# Altium project LM_HTR_001_Rev_C1.PrjPcb (part 1 of 2)
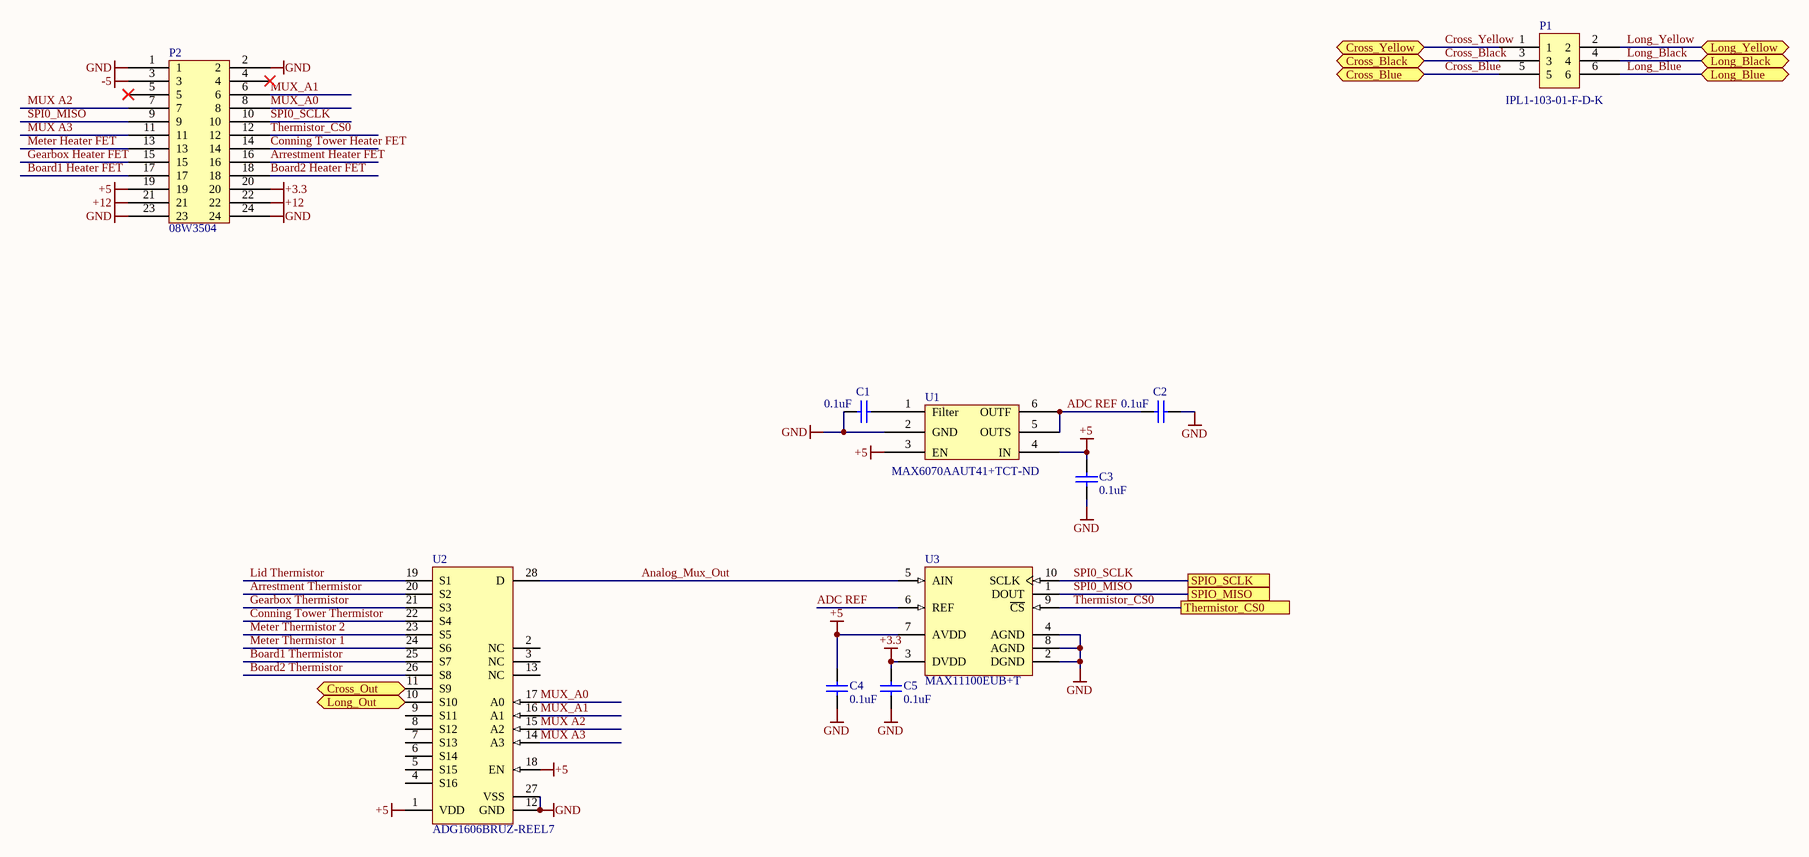
[diagram p0: LM_HTR_001.SchDoc]
5 sheets, 183 parts. Net scope: flat (ports and power ports of the same name join across sheets).
Board file: LM_HTR_001.PcbDoc
Sheets:
  LM_HTR_001.SchDoc
  Signal_Conditioner.SchDoc
  HTR_Bridge1.SchDoc
  HTR_Bridge2.SchDoc
  HTR_Bridge3.SchDoc

## Sheet LM_HTR_001.SchDoc: Land Meter Heater Assembly
size Tabloid; DocumentNumber: LM_HTR_001; Revision: A; SheetNumber: 1; SheetTotal: 1

### Parts
C1  0.1uF  [CAPC0402(1005)60_L]
C2  0.1uF  [CAPC0402(1005)60_L]
C3  0.1uF  [CAPC0402(1005)60_L]
C4  0.1uF  [CAPC0402(1005)60_L]
C5  0.1uF  [CAPC0402(1005)60_L]
P1  Manufacturer Part Number: IPL1-103-01-F-D-K  [IPL1-103-01-F-D]  (hidden comment: IPL1-103-01-F-D)
P2  Supplier Part Number 1: 08W3504  [IPL1-112-01-F-S-K]  (hidden comment: IPL1-112-01-F-S-K)
U1  Supplier Part Number 1: MAX6070AAUT41+TCT-ND  [SOT95P280X445-6N]  (hidden comment: MAX6070AAUT41+T)
U2  ADG1606BRUZ-REEL7  [ADI-RU-28_M]
U3  MAX11100EUB+T  [U10+2_L]

### Ports
Cross_Black, Cross_Blue, Cross_Out, Cross_Yellow, Long_Black, Long_Blue, Long_Out, Long_Yellow, SPIO_MISO, SPIO_SCLK, Thermistor_CS0

### Nets
+3.3: C5.1 P2.20 U3.3(DVDD)
+5: C3.1 C4.1 P2.19 U1.3(EN) U1.4(IN) U2.1(VDD) U2.18(EN) U3.7(AVDD)
+12: P2.21 P2.22
-5: P2.3
GND: C1.2 C2.1 C3.2 C4.2 C5.2 P2.1 P2.2 P2.23 P2.24 U1.2(GND) U2.12(GND) U2.27(VSS) U3.2(DGND) U3.4(AGND) U3.8(AGND)
ADC REF: C2.2 U1.5(OUTS) U1.6(OUTF) U3.6(REF)
Analog_Mux_Out: U2.28(D) U3.5(AIN)
Arrestment Heater FET: P2.16
Arrestment Thermistor: U2.20(S2)
Board1 Heater FET: P2.17
Board1 Thermistor: U2.25(S7)
Board2 Heater FET: P2.18
Board2 Thermistor: U2.26(S8)
Conning Tower Heater FET: P2.14
Conning Tower Thermistor: U2.22(S4)
Cross_Black: P1.3 ; port Cross_Black  [project net CROSS NEUTRAL]
Cross_Blue: P1.5 ; port Cross_Blue
Cross_Yellow: P1.1 ; port Cross_Yellow
Gearbox Heater FET: P2.15
Gearbox Thermistor: U2.21(S3)
Lid Thermistor: U2.19(S1)
Long_Black: P1.4 ; port Long_Black  [project net LONG NEUTRAL]
Long_Blue: P1.6 ; port Long_Blue
Long_Yellow: P1.2 ; port Long_Yellow
Meter Heater FET: P2.13
Meter Thermistor 1: U2.24(S6)
Meter Thermistor 2: U2.23(S5)
MUX A2: P2.7 U2.15(A2)
MUX A3: P2.11 U2.14(A3)
MUX_A0: P2.8 U2.17(A0)
MUX_A1: P2.6 U2.16(A1)
SPI0_MISO: P2.9 U3.1(DOUT) ; port SPIO_MISO
SPI0_SCLK: P2.10 U3.10(SCLK) ; port SPIO_SCLK
Thermistor_CS0: P2.12 U3.9(~{CS}) ; port Thermistor_CS0
NetC1_1: C1.1 U1.1(Filter)
NetTP2_1: U2.10(S10) ; port Long_Out
NetTP6_1: U2.11(S9) ; port Cross_Out

Not connected (* = marked no-connect by the designer): P2 4* 5*; U2 2(NC) 3(NC) 4(S16) 5(S15) 6(S14) 7(S13) 8(S12) 9(S11) 13(NC)

### Notes on the sheet
- Title
- Size:
- Date:
- Tabloid
- Number:
- Time:
- Revision:
- Sheet
- of
- ZLS Corporation
- 7801 North Lamar Blvd.
- Suite E-184
- Austin, Texas 78752  USA
- (512) 453-0288
- File:

### Library data of the parts
C1-C5 = CMP-1034-00252-1: CAP CER 0.1UF 10V X7R 0402; Manufacturer: Murata Electronics North America; Manufacturer Part Number: GRM155R71A104KA01D; Tolerance: ±10%; Supplier 1: Digi-Key; Supplier Part Number 1: 490-6321-1-ND; RoHS: RoHS Compliant; Category: Capacitors; Stock 1: 2920395; Pricing 1: 1=0.1, 10=0.014, 100=0.0063, 500=0.00446, 1000=0.00351, 2500=0.00319, 5000=0.00293 (USD); Packaging: Cut Tape (CT); Part Status: Active; Voltage - Rated: 10V; Temperature Coefficient: X7R; Operating Temperature: -55°C ~ 125°C; Features: -; Ratings: -; Applications: General Purpose; Mounting Type: Surface Mount, MLCC; Package / Case: 0402 (1005 Metric); Size / Dimension: 0.039" L x 0.020" W (1.00mm x 0.50mm); Height - Seated (Max): -; Thickness (Max): 0.022" (0.55mm); Lead Spacing: -; ComponentLink1URL: http://www.murata.com/~/media/webrenewal/support/library/catalog/products/capacitor/mlcc/c02e.ashx?la=en-us; ComponentLink1Description: http://www.murata.com/~/media/webrenewal/support/library/catalog/products/capacitor/mlcc/c02e.ashx?la=en-us
P1 = IPL1-103-01-F-D: Manufacturer: SAMTEC; Supplier 1: Newark; Supplier Part Number 1: 51P2678; Stock 1: 0; Pricing 1: 1=1.8, 5000=1.56, 10000=1.46 (USD); ComponentLink1URL: https://webassistants.partcommunity.com/23d-libs/samtec/search/resolve.html?EMAIL=mysamtec@samtec.com&PN=HTSW-114-05-F-D; ComponentLink1Description: https://webassistants.partcommunity.com/23d-libs/samtec/search/resolve.html?EMAIL=mysamtec@samtec.com&PN=HTSW-114-05-F-D
P2 = IPL1-112-01-F-S-K: IPL1-112-01-F-D-K; Supplier 1: Newark
U1 = MAX6070AAUT41+T: IC VREF SERIES 4.096V SOT23; Manufacturer: Maxim Integrated; Output Type: Fixed; Tolerance: ±0.04%; Temperature Coefficient: 6ppm/°C; Noise - 0.1Hz to 10Hz: 9.6µVp-p; Noise - 10Hz to 10kHz: 9µVrms; Voltage - Input: 4.3 V ~ 5.5 V; Current - Supply: 350µA; Supplier 1: Digi-Key; Manufacturer Part Number: MAX6070AAUT41+T; RoHS: RoHS Compliant; Category: Integrated Circuits (ICs); Stock 1: 2623; Pricing 1: 1=3.41, 10=3.213, 25=2.5704, 50=2.4418, 100=2.2491, 250=2.13344, 500=2.05634 (USD); Packaging: Cut Tape (CT); Part Status: Active; Reference Type: Series; Voltage - Output (Min/Fixed): 4.096V; Operating Temperature: -40°C ~ 125°C (TA); Mounting Type: Surface Mount; Package / Case: SOT-23-6; Supplier Device Package: SOT-23-6; ComponentLink1URL: https://datasheets.maximintegrated.com/en/ds/MAX6070-MAX6071.pdf; ComponentLink1Description: https://datasheets.maximintegrated.com/en/ds/MAX6070-MAX6071.pdf
U2 = CMP-0793-00166-1: 4.5 Ohm Ron, 16-Channel, +/-5 V,+12 V,+5 V and +3.3 V Multiplexer, 28-pin SOP (RU-28), Reel; Manufacturer: Analog Devices; Ron (ohms): 4; t transition (s): 143n; Bandwidth (Hz): 21M, 22M, 19M, 17M; Max Analog Signal Range: Vss to Vdd; ComponentLink1URL: http://www.analog.com/en/index.html; PartNumber: ADG1606BRUZ-REEL7; ComponentLink3URL: http://www.analog.com/static/imported-files/packages/249854663RU_28.pdf; ComponentLink2URL: http://www.analog.com/static/imported-files/data_sheets/ADG1606_1607.pdf; ComponentLink2Description: Datasheet; Mounting Technology: Surface Mount; PackageDescription: 28-Pin Thin Shrink Small Outline Package, Body 9.7 x 4.4 mm, Pitch 0.65 mm; PackageReference: RU-28; ComponentLink3Description: Package Specification; Packing: Reel; Code_JEDEC: MO-153-AE; DatasheetVersion: Rev. 0; ComponentLink1Description: Manufacturer URL; PackageVersion: Mar-05
U3 = CMP-0249-00017-1: 16-Bit, +5V, 200ksps ADC with 10uA Shutdown, 10-Pin uMAX, -40°C to +85°C, Pb-Free, Tape and Reel; DatasheetVersion: Rev 1, Jan-2012; ComponentLink3URL: http://pdfserv.maxim-ic.com/package_dwgs/21-0061.PDF; PackageReference: U10+2; ComponentLink2URL: http://datasheets.maxim-ic.com/en/ds/MAX11100.pdf; PackageVersion: revL, 2008; ComponentLink1Description: Manufacturer URL; Code_JEDEC: MO-187-BA; ComponentLink1URL: http://www.maxim-ic.com; ComponentLink3Description: Package Specification; PackageDescription: 10-Pin Micro-MAX Thin Shrink Small Outline (uSOP), 3 x 3 x 0.85 mm Body, 0.5 mm Pitch, Pb-Free; ComponentLink2Description: Datasheet

## Sheet Signal_Conditioner.SchDoc: Signal Conditioner
size Tabloid; DocumentNumber: LM-001; Revision: C; SheetNumber: 2; SheetTotal: 2; DocumentName: Signal Conditioner
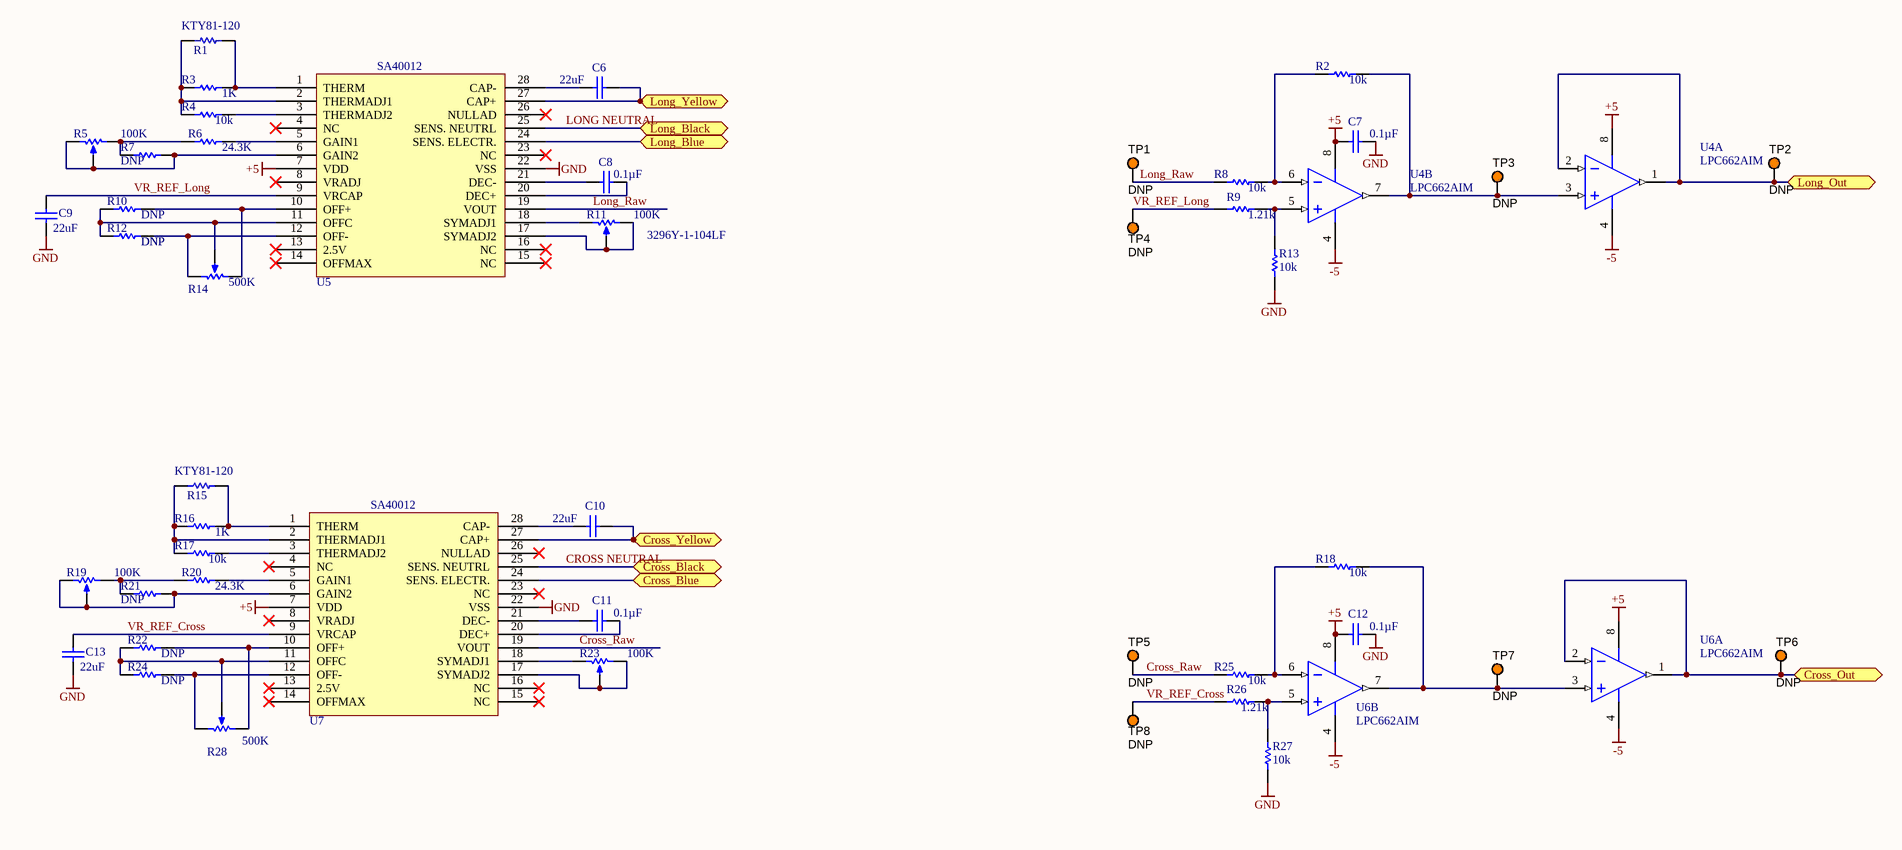
[diagram p1: Signal_Conditioner.SchDoc]

### Parts
C6  22uF  [CAPC0805(2012)145_N]
C7  Capacitance: 0.1µF  [CAPC0805(2012)145_N]  (hidden comment: CAP CER 0.1UF 25V X7R 0805)
C8  Capacitance: 0.1µF  [CAPC0805(2012)145_N]  (hidden comment: CAP CER 0.1UF 25V X7R 0805)
C9  22uF  [CAPC0805(2012)145_N]
C10  22uF  [CAPC0805(2012)145_N]
C11  Capacitance: 0.1µF  [CAPC0805(2012)145_N]  (hidden comment: CAP CER 0.1UF 25V X7R 0805)
C12  Capacitance: 0.1µF  [CAPC0805(2012)145_N]  (hidden comment: CAP CER 0.1UF 25V X7R 0805)
C13  22uF  [CAPC0805(2012)145_N]
R1  KTY81-120  [KTY81-120]
R2  10k  [RESC0805(2012)_L]
R3  1K  [RESC0805(2012)_L]
R4  10k  [RESC0805(2012)_L]
R5  100K  [Trimmer 2.54]
R6  24.3K  [RESC0805(2012)_L]
R7  DNP  [RESC0805(2012)_L]
R8  10k  [RESC0805(2012)_L]
R9  1.21k  [RESC0805(2012)_L]
R10  DNP  [RESC0805(2012)_L]
R11  100K  [Trimmer 2.54]
R12  DNP  [RESC0805(2012)_L]
R13  10k  [RESC0805(2012)_L]
R14  500K  [Trimmer 2.54]
R15  KTY81-120  [KTY81-120]
R16  1K  [RESC0805(2012)_L]
R17  10k  [RESC0805(2012)_L]
R18  10k  [RESC0805(2012)_L]
R19  100K  [Trimmer 2.54]
R20  24.3K  [RESC0805(2012)_L]
R21  DNP  [RESC0805(2012)_L]
R22  DNP  [RESC0805(2012)_L]
R23  100K  [Trimmer 2.54]
R24  DNP  [RESC0805(2012)_L]
R25  10k  [RESC0805(2012)_L]
R26  1.21k  [RESC0805(2012)_L]
R27  10k  [RESC0805(2012)_L]
R28  500K  [Trimmer 2.54]
TP1  DNP  [KSTN-5003]
TP2  DNP  [KSTN-5003]
TP3  DNP  [KSTN-5003]
TP4  DNP  [KSTN-5003]
TP5  DNP  [KSTN-5003]
TP6  DNP  [KSTN-5003]
TP7  DNP  [KSTN-5003]
TP8  DNP  [KSTN-5003]
U4  LPC662AIM  [D0008A_M]  (parts A,B of 2)
U5  SA40012  [SA40012]
U6  LPC662AIM  [D0008A_M]  (parts A,B of 2)
U7  SA40012  [SA40012]

### Ports
Cross_Black, Cross_Blue, Cross_Out, Cross_Yellow, Long_Black, Long_Blue, Long_Out, Long_Yellow

### Nets
+5: C7.1 C12.1 U4.8(V+) U5.7(VDD) U6.8(V+) U7.7(VDD)
-5: U4.4(V-) U6.4(V-)
GND: C7.2 C9.2 C12.2 C13.2 R13.1 R27.1 U5.22(VSS) U7.22(VSS)
CROSS NEUTRAL: U7.25(SENS._NEUTRL) ; port Cross_Black
Cross_Blue: U7.24(SENS._ELECTR.) ; port Cross_Blue
Cross_Raw: R25.1 TP5.1 U7.19(VOUT)
Cross_Yellow: C10.2 U7.27(CAP+) ; port Cross_Yellow
LONG NEUTRAL: U5.25(SENS._NEUTRL) ; port Long_Black
Long_Blue: U5.24(SENS._ELECTR.) ; port Long_Blue
Long_Raw: R8.1 TP1.1 U5.19(VOUT)
Long_Yellow: C6.2 U5.27(CAP+) ; port Long_Yellow
VR_REF_Cross: C13.1 R26.2 TP8.1 U7.9(VRCAP)
VR_REF_Long: C9.1 R9.2 TP4.1 U5.9(VRCAP)
NetC6_1: C6.1 U5.28(CAP-)
NetC8_1: C8.1 U5.21(DEC-)
NetC8_2: C8.2 U5.20(DEC+)
NetC10_1: C10.1 U7.28(CAP-)
NetC11_1: C11.1 U7.21(DEC-)
NetC11_2: C11.2 U7.20(DEC+)
NetR1_1: R1.1 R3.1 R4.1 U5.2(THERMADJ1)
NetR1_2: R1.2 R3.2 U5.1(THERM)
NetR2_1: R2.1 R8.2 U4.6(INB-)
NetR2_2: R2.2 TP3.1 U4.3(INA+) U4.7(OUTB)
NetR4_2: R4.2 U5.3(THERMADJ2)
NetR5_1: R5.1(a) R5.2(b) R7.2 U5.6(GAIN2)
NetR5_3: R5.3(c) R6.1 R7.1
NetR6_2: R6.2 U5.5(GAIN1)
NetR9_1: R9.1 R13.2 U4.5(INB+)
NetR10_1: R10.1 R12.1 R14.2(b) U5.11(OFFC)
NetR10_2: R10.2 R14.1(a) U5.10(OFF+)
NetR11_1: R11.1(a) U5.18(SYMADJ1)
NetR11_2: R11.2(b) R11.3(c) U5.17(SYMADJ2)
NetR12_2: R12.2 R14.3(c) U5.12(OFF-)
NetR15_1: R15.1 R16.1 R17.1 U7.2(THERMADJ1)
NetR15_2: R15.2 R16.2 U7.1(THERM)
NetR17_2: R17.2 U7.3(THERMADJ2)
NetR18_1: R18.1 R25.2 U6.6(INB-)
NetR18_2: R18.2 TP7.1 U6.3(INA+) U6.7(OUTB)
NetR19_1: R19.1(a) R19.2(b) R21.2 U7.6(GAIN2)
NetR19_3: R19.3(c) R20.1 R21.1
NetR20_2: R20.2 U7.5(GAIN1)
NetR22_1: R22.1 R24.1 R28.2(b) U7.11(OFFC)
NetR22_2: R22.2 R28.1(a) U7.10(OFF+)
NetR23_1: R23.1(a) U7.18(SYMADJ1)
NetR23_2: R23.2(b) R23.3(c) U7.17(SYMADJ2)
NetR24_2: R24.2 R28.3(c) U7.12(OFF-)
NetR26_1: R26.1 R27.2 U6.5(INB+)
NetTP2_1: TP2.1 U4.1(OUTA) U4.2(INA-) ; port Long_Out
NetTP6_1: TP6.1 U6.1(OUTA) U6.2(INA-) ; port Cross_Out

Not connected (* = marked no-connect by the designer): U5 4(NC)* 8(VRADJ)* 13(2.5V)* 14(OFFMAX)* 15(NC)* 16(NC)* 23(NC)* 26(NULLAD)*; U7 4(NC)* 8(VRADJ)* 13(2.5V)* 14(OFFMAX)* 15(NC)* 16(NC)* 23(NC)* 26(NULLAD)*

### Notes on the sheet
- (near R12) DNP
- (near R11) 3296Y-1-104LF
- Title
- Size:
- Date:
- Tabloid
- Number:
- Time:
- Revision:
- Sheet
- of
- ZLS Corporation
- 7801 North Lamar Blvd.
- Suite E-184
- Austin, Texas 78752  USA
- (512) 453-0288
- File:

### Library data of the parts
C6 C9 C10 C13 = CMP-1036-04795-1: CAP CER 22UF 16V X5R 0805; Manufacturer: Murata Electronics North America; Manufacturer Part Number: GRM219R61C226ME15L; Tolerance: ±20%; Notification: Current market demand for these product types have resulted in fluctuating and extending lead times. Lead times may differ.; Supplier 1: Digi-Key; Supplier Part Number 1: 490-9952-1-ND; RoHS: RoHS Compliant; Category: Capacitors; Stock 1: 200; Pricing 1: 1=0.51, 10=0.359, 100=0.2364, 500=0.1751, 1000=0.14884 (USD); Packaging: Cut Tape (CT); Part Status: Active; Voltage - Rated: 16V; Temperature Coefficient: X5R; Operating Temperature: -55°C ~ 85°C; Features: -; Ratings: -; Applications: General Purpose; Mounting Type: Surface Mount, MLCC; Package / Case: 0805 (2012 Metric); Size / Dimension: 0.079" L x 0.049" W (2.00mm x 1.25mm); Height - Seated (Max): -; Thickness (Max): 0.039" (1.00mm); Lead Spacing: -; Lead Style: -; ComponentLink1URL: http://search.murata.co.jp/Ceramy/image/img/A01X/G101/ENG/GRM219R61C226ME15-01.pdf; ComponentLink1Description: http://search.murata.co.jp/Ceramy/image/img/A01X/G101/ENG/GRM219R61C226ME15-01.pdf
C7 C8 C11 C12 = CMP-1036-04795-1: Manufacturer: Murata Electronics North America; Manufacturer Part Number: GRM21BR71E104KA01L; Tolerance: ±10%; Supplier 1: Digi-Key; Supplier Part Number 1: 490-1673-6-ND; RoHS: RoHS Compliant; Category: Capacitors; Stock 1: 891652; Pricing 1: 1=0.2, 10=0.145, 100=0.0683, 500=0.04788, 1000=0.03964 (USD); Packaging: Digi-Reel®; Part Status: Active; Voltage - Rated: 25V; Temperature Coefficient: X7R; Operating Temperature: -55°C ~ 125°C; Features: -; Ratings: -; Applications: General Purpose; Mounting Type: Surface Mount, MLCC; Package / Case: 0805 (2012 Metric); Size / Dimension: 0.079" L x 0.049" W (2.00mm x 1.25mm); Height - Seated (Max): -; Thickness (Max): 0.053" (1.35mm); Lead Spacing: -; Lead Style: -; ComponentLink1URL: http://www.murata.com/~/media/webrenewal/support/library/catalog/products/capacitor/mlcc/c02e.ashx; ComponentLink1Description: http://www.murata.com/~/media/webrenewal/support/library/catalog/products/capacitor/mlcc/c02e.ashx
R1 R15 = KTY81-120: THERMISTOR PTC 1K OHM PBCYT2; Manufacturer: NXP USA Inc.; Manufacturer Part Number: KTY81/120,112; Supplier 1: Digi-Key; Supplier Part Number 1: 568-12506-ND; RoHS: RoHS Compliant; Category: Sensors, Transducers; Stock 1: 2002; Pricing 1: 1=1.11, 5=1.068, 10=0.868, 25=0.748, 50=0.648, 100=0.5878, 500=0.49432, 1000=0.44088, 5000=0.4008 (USD); Packaging: Bulk; Part Status: Active; Resistance Tolerance: -; Operating Temperature: -55°C ~ 150°C; Mounting Type: Through Hole; Package / Case: TO-226-2, TO-92-2 (TO-226AC); Supplier Device Package: PBCYT2; ComponentLink1URL: http://www.nxp.com/documents/data_sheet/KTY81_SER.pdf; ComponentLink1Description: http://www.nxp.com/documents/data_sheet/KTY81_SER.pdf
R2 R4 R7 R8 R13 R17 R18 R21 R25 R27 = CMP-1013-00393-1: RES SMD 10K OHM 1% 1/8W 0805; Manufacturer: Vishay Dale; Manufacturer Part Number: CRCW080510K0FKEA; Power (Watts): 0.125W, 1/8W; Temperature Coefficient: ±100ppm/°C; Supplier 1: Digi-Key; Supplier Part Number 1: 541-10.0KCCT-ND; RoHS: RoHS Compliant; Category: Resistors; Stock 1: 1858038; Pricing 1: 1=0.1, 10=0.055, 100=0.0223, 1000=0.01003, 2500=0.0087 (USD); Packaging: Cut Tape (CT); Part Status: Active; Tolerance: ±1%; Composition: Thick Film; Features: Automotive AEC-Q200; Operating Temperature: -55°C ~ 155°C; Package / Case: 0805 (2012 Metric); Supplier Device Package: 0805; Size / Dimension: 0.079" L x 0.049" W (2.00mm x 1.25mm); Height - Seated (Max): 0.020" (0.50mm); Failure Rate: -; ComponentLink1URL: http://www.vishay.com/docs/20035/dcrcwe3.pdf; ComponentLink1Description: http://www.vishay.com/docs/20035/dcrcwe3.pdf
R3 R16 = CMP-1013-00393-1: RES SMD 1K OHM 1% 1/8W 0805; Manufacturer: Vishay Dale; Manufacturer Part Number: CRCW08051K00FKEA; Power (Watts): 0.125W, 1/8W; Temperature Coefficient: ±100ppm/°C; Supplier 1: Digi-Key; Supplier Part Number 1: 541-1.00KCCT-ND; RoHS: RoHS Compliant; Category: Resistors; Stock 1: 157631; Pricing 1: 1=0.1, 10=0.055, 100=0.0223, 1000=0.01003, 2500=0.0087 (USD); Packaging: Cut Tape (CT); Part Status: Active; Tolerance: ±1%; Composition: Thick Film; Features: Automotive AEC-Q200; Operating Temperature: -55°C ~ 155°C; Package / Case: 0805 (2012 Metric); Supplier Device Package: 0805; Size / Dimension: 0.079" L x 0.049" W (2.00mm x 1.25mm); Height - Seated (Max): 0.020" (0.50mm); Failure Rate: -; ComponentLink1URL: http://www.vishay.com/docs/20035/dcrcwe3.pdf; ComponentLink1Description: http://www.vishay.com/docs/20035/dcrcwe3.pdf
R5 R11 R19 R23 = Trimmer: TRIMMER 5K OHM 0.25W PC PIN; Manufacturer: Bourns Inc.; Manufacturer Part Number: 3296Y-1-104LF; Power (Watts): 0.5W, 1/2W; Tolerance: ±10%; Temperature Coefficient: ±100ppm/°C; Adjustment Type: Top Adjustment; Resistive Material: Cermet; Supplier 1: Digi-Key; Supplier Part Number 1: 3296Y-104LF-ND; RoHS: RoHS Compliant; Category: Potentiometers, Variable Resistors; Stock 1: 10872; Pricing 1: 1=2.41, 10=2.117, 25=1.898, 50=1.825, 100=1.752, 250=1.679, 500=1.387, 1000=1.314, 5000=1.095 (USD); Packaging: Tube; Part Status: Active; Mounting Type: Through Hole; Termination Style: PC Pins; Size / Dimension: Rectangular - 0.375" x 0.190" Face x 0.395" H (9.53mm x 4.83mm x 10.03mm); ComponentLink1URL: https://www.bourns.com/docs/Product-Datasheets/3296.pdf; ComponentLink1Description: https://www.bourns.com/docs/Product-Datasheets/3296.pdf
R6 R20 = CMP-1013-00393-1: RES SMD 24.3K OHM 1% 1/8W 0805; Manufacturer: Vishay Dale; Manufacturer Part Number: CRCW080524K3FKEA; Power (Watts): 0.125W, 1/8W; Temperature Coefficient: ±100ppm/°C; Supplier 1: Digi-Key; Supplier Part Number 1: 541-24.3KCCT-ND; RoHS: RoHS Compliant; Category: Resistors; Stock 1: 35; Pricing 1: 1=0.1, 10=0.055, 100=0.0223, 1000=0.01003, 2500=0.0087 (USD); Packaging: Cut Tape (CT); Part Status: Active; Tolerance: ±1%; Composition: Thick Film; Features: Automotive AEC-Q200; Operating Temperature: -55°C ~ 155°C; Package / Case: 0805 (2012 Metric); Supplier Device Package: 0805; Size / Dimension: 0.079" L x 0.049" W (2.00mm x 1.25mm); Height - Seated (Max): 0.020" (0.50mm); Failure Rate: -; ComponentLink1URL: http://www.vishay.com/docs/20035/dcrcwe3.pdf; ComponentLink1Description: http://www.vishay.com/docs/20035/dcrcwe3.pdf
R9 R26 = CMP-1013-00393-1: RES SMD 1.21K OHM 1% 1/8W 0805; Manufacturer: Vishay Dale; Manufacturer Part Number: CRCW08051K21FKEA; Power (Watts): 0.125W, 1/8W; Temperature Coefficient: ±100ppm/°C; Supplier 1: Digi-Key; Supplier Part Number 1: 541-1.21KCCT-ND; RoHS: RoHS Compliant; Category: Resistors; Stock 1: 93438; Pricing 1: 1=0.1, 10=0.055, 100=0.0223, 1000=0.01003, 2500=0.0087 (USD); Packaging: Cut Tape (CT); Part Status: Active; Tolerance: ±1%; Composition: Thick Film; Features: Automotive AEC-Q200; Operating Temperature: -55°C ~ 155°C; Package / Case: 0805 (2012 Metric); Supplier Device Package: 0805; Size / Dimension: 0.079" L x 0.049" W (2.00mm x 1.25mm); Height - Seated (Max): 0.020" (0.50mm); Failure Rate: -; ComponentLink1URL: http://www.vishay.com/docs/20035/dcrcwe3.pdf; ComponentLink1Description: http://www.vishay.com/docs/20035/dcrcwe3.pdf
R10 R12 R22 R24 = CMP-1013-00393-1: RES SMD 249K OHM 1% 1/8W 0805; Manufacturer: Vishay Dale; Manufacturer Part Number: CRCW0805249KFKECC; Power (Watts): 0.125W, 1/8W; Temperature Coefficient: ±100ppm/°C; Supplier 1: Digi-Key; Supplier Part Number 1: 541-4128-1-ND; RoHS: RoHS Compliant; Category: Resistors; Stock 1: 19464; Pricing 1: 1=0.1, 10=0.06, 100=0.0244, 1000=0.01094, 2500=0.0095, 5000=0.00785 (USD); Packaging: Cut Tape (CT); Part Status: Active; Tolerance: ±1%; Composition: Thick Film; Features: -; Operating Temperature: -55°C ~ 155°C; Package / Case: 0805 (2012 Metric); Supplier Device Package: 0805; Size / Dimension: 0.079" L x 0.049" W (2.00mm x 1.25mm); Height - Seated (Max): 0.024" (0.60mm); Failure Rate: -; ComponentLink1URL: http://www.vishay.com/docs/28773/crcwce3.pdf; ComponentLink1Description: http://www.vishay.com/docs/28773/crcwce3.pdf
R14 R28 = Trimmer: TRIMMER 500K OHM 0.5W PC PIN TOP; Manufacturer: Bourns Inc.; Manufacturer Part Number: 3296Y-1-504LF; Power (Watts): 0.5W, 1/2W; Tolerance: ±10%; Temperature Coefficient: ±100ppm/°C; Adjustment Type: Top Adjustment; Resistive Material: Cermet; Supplier 1: Digi-Key; Supplier Part Number 1: 3296Y-504LF-ND; RoHS: RoHS Compliant; Category: Potentiometers, Variable Resistors; Stock 1: 2109; Pricing 1: 1=2.41, 10=2.117, 25=1.898, 50=1.825, 100=1.752, 300=1.679, 500=1.387, 1000=1.314, 5000=1.095 (USD); Packaging: Tube; Part Status: Active; Mounting Type: Through Hole; Termination Style: PC Pins; Size / Dimension: Rectangular - 0.375" x 0.190" Face x 0.395" H (9.53mm x 4.83mm x 10.03mm); ComponentLink1URL: https://www.bourns.com/docs/Product-Datasheets/3296.pdf; ComponentLink1Description: https://www.bourns.com/docs/Product-Datasheets/3296.pdf
TP1-TP8 = CMP-1672-00009-1: Test Point, Orange, 1-Pin THD, RoHS; Manufacturer: Keystone Electronics; Manufacturer Part Number: 5003; Peak Reverse Current: 600 uA; Forward Current: 3 A; Max Surge Current: 80 A; Forward Voltage: 1.08 V; Plating: Silver; Body Material: PBT; Outside Diameter: 2.54mm; Inside Diameter: 1.27mm; Max Operating Temperature: 150 degC; PackageReference: 5003; Pins: 2; ComponentLink2URL: http://keyelco.com/userAssets/file/M65p56.pdf; PackageDescription: 1-Pin Through Hole Device, Dia 2.54 mm; Weight: 0.01 lb; Diameter: 5.3 mm; Mount: Through Hole; Package Quantity: 500; Packaging: Bulk; Min Operating Temperature: -65 degC; ComponentLink1Description: Manufacturer URL; Height: 0.25 inch; ComponentLink1URL: http://www.keyelco.com/; ComponentLink2Description: Datasheet; Width: 0.25 inch; REACH SVHC: No SVHC; RoHSCompliant: true; Radiation Hardening: No; Length: 9.5 mm; DatasheetVersion: Jun-15; Supplier 1: Future Electronics; Supplier Part Number 1: 1432640; Stock 1: 5752; Pricing 1: 100=0.176, 500=0.148, 1000=0.146, 2000=0.143, 4000=0.141 (USD); Number of Pins: 1; Colour: Orange,White; Contact Material: Bronze; Contact Plating: Silver,Tin; Material: Bronze,Nylon,Silver; Termination: Through Hole; Lead Free: Lead Free; Flammability Rating: UL94 V-0
U4 = CMP-0055-00867-3: Low Power CMOS Dual Operational Amplifier, 8-pin Narrow SOIC; Manufacturer: Texas Instruments; PowerWise: N; CompType: Amplifiers; PackageTopMarking: NSZXTT*LPC66*2AIM; PinCount: 8; Code_JEDEC: MS-012-AA; ComponentLink1URL: http://www.ti.com/general/docs/lit/getliterature.tsp?genericPartNumber=LPC662&fileType=pdf; Code_IPC: SOIC127P600-8; Package Reference: D0008A; PackageDescription: SOIC Narrow, 4.9 x 3.9 x 1.45mm, 8 Lead, 1.27mm Pitch; RoHS: N; ComponentLink1Description: Datasheet URL; PartId: 1
U5 U7 = SA40012: Single Axix CMOS Signal Conditioning Module; Manufacturer: Spectron; Manufacturer Part Number: A40012
U6 = CMP-0055-00867-3: Low Power CMOS Dual Operational Amplifier, 8-pin Narrow SOIC; Manufacturer: Texas Instruments; Manufacturer Part Number: LPC662AIMX/NOPB; Amplifier Type: General Purpose; Output Type: Rail-to-Rail; Slew Rate: 0.11 V/µs; Current - Supply: 86µA; Voltage - Supply, Single/Dual (±): 4.75 V ~ 15.5 V, ±2.38 V ~ 7.75 V; Supplier 1: Digi-Key; Supplier Part Number 1: 296-35456-1-ND; RoHS: RoHS Compliant; Category: Integrated Circuits (ICs); Stock 1: 4976; Pricing 1: 1=2.98, 10=2.672, 100=2.1893, 500=1.86368, 1000=1.57178 (USD); Packaging: Cut Tape (CT); Part Status: Active; Operating Temperature: -40°C ~ 85°C; Mounting Type: Surface Mount; Package / Case: 8-SOIC (0.154", 3.90mm Width); Supplier Device Package: 8-SOIC; Base Part Number: LPC662; ComponentLink1URL: http://www.ti.com/lit/ds/symlink/lpc662.pdf; ComponentLink1Description: http://www.ti.com/lit/ds/symlink/lpc662.pdf

## Sheet HTR_Bridge1.SchDoc
size Tabloid
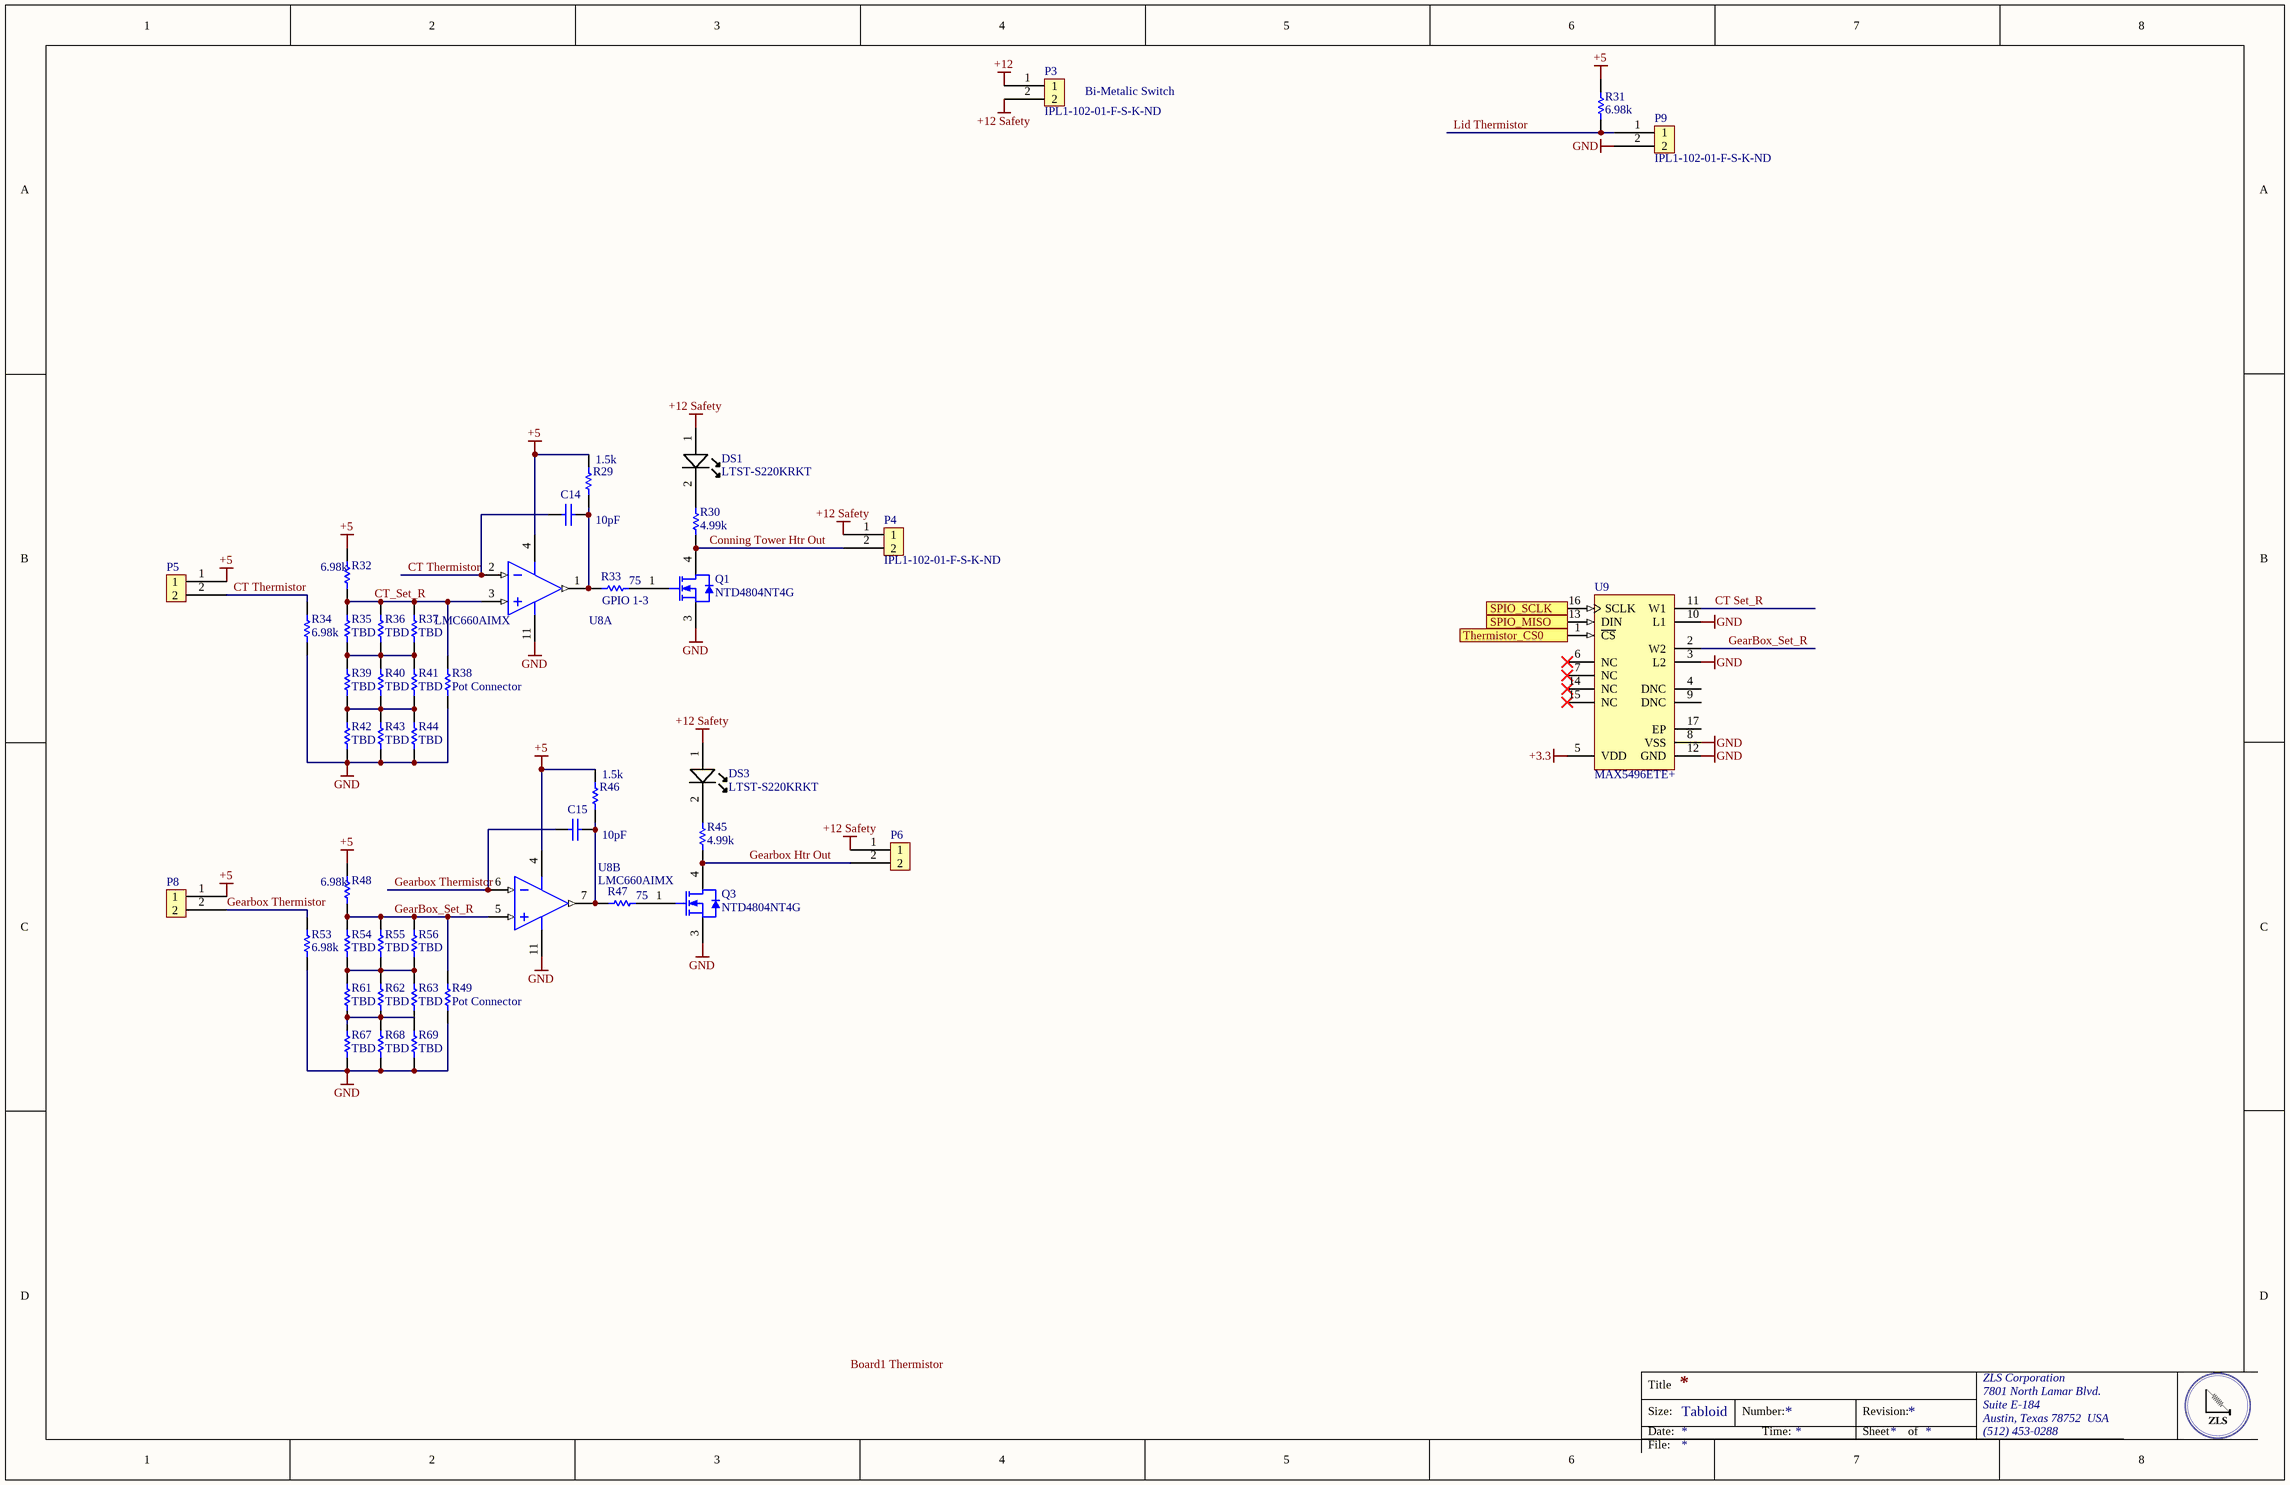
[diagram p2: HTR_Bridge1.SchDoc]

### Parts
(Parts that share a designator on the sheet are numbered #1, #2 ... from top to bottom, then left to right.)
C14#1  Capacitance: 10pF  [CAPC0805(2012)145_N]  (hidden comment: CAP CER 0.1UF 25V X7R 0805)
C15  Capacitance: 10pF  [CAPC0805(2012)145_N]  (hidden comment: CAP CER 0.1UF 25V X7R 0805)
DS1#1  Manufacturer Part Number: LTST-S220KRKT  [0805C_L]  (hidden comment: Visible Name Value Type    False Description Lite-On LTST-S220KRKT Red LED, 631 nm 2012 (0805) Side View, Rectangle Lens SMD package STRING)
DS3#1  Manufacturer Part Number: LTST-S220KRKT  [0805C_L]  (hidden comment: Visible Name Value Type    False Description Lite-On LTST-S220KRKT Red LED, 631 nm 2012 (0805) Side View, Rectangle Lens SMD package STRING)
P3  Supplier Part Number 1: IPL1-102-01-F-S-K-ND  [IPL1-102-01-F-S-K]  (hidden comment: IPL1-102-01-F-S-K)
P4#1  Supplier Part Number 1: IPL1-102-01-F-S-K-ND  [IPL1-102-01-F-S-K]  (hidden comment: IPL1-102-01-F-S-K)
P5#1  IPL1-102-01-F-S-K  [IPL1-102-01-F-S-K]  (value not drawn)
P6#1  IPL1-102-01-F-S-K  [IPL1-102-01-F-S-K]  (value not drawn)
P8#1  IPL1-102-01-F-S-K  [IPL1-102-01-F-S-K]  (value not drawn)
P9  Supplier Part Number 1: IPL1-102-01-F-S-K-ND  [IPL1-102-01-F-S-K]  (hidden comment: IPL1-102-01-F-S-K)
Q1#1  NTD4804NT4G  [ONSC-DPAK-3-369AA-01_V]
Q3#1  NTD4804NT4G  [ONSC-DPAK-3-369AA-01_V]
R29#1  1.5k  [RESC0805(2012)_N]
R30#1  Resistance (Ohms): 4.99k  [RESC0805(2012)_L]
R31  Resistance (Ohms): 6.98k  [RESC0805(2012)_N]  (hidden comment: 6K98 1% 0805(2012))
R32#1  Resistance (Ohms): 6.98k  [RESC0805(2012)_N]  (hidden comment: 6K98 1% 0805(2012))
R33#1  Resistance (Ohms): 75  [RESC0805(2012)_L]
R34#1  Resistance (Ohms): 6.98k  [RESC0805(2012)_N]  (hidden comment: 6K98 1% 0805(2012))
R35#1  TBD  [RESC0805(2012)_N]
R36#1  TBD  [RESC0805(2012)_N]
R37#1  TBD  [RESC0805(2012)_N]
R38  Pot Connector  [AXIAL-0.3]
R39#1  TBD  [RESC0805(2012)_N]
R40#1  TBD  [RESC0805(2012)_N]
R41#1  TBD  [RESC0805(2012)_N]
R42#1  TBD  [RESC0805(2012)_N]
R43#1  TBD  [RESC0805(2012)_N]
R44#1  TBD  [RESC0805(2012)_N]
R45#1  Resistance (Ohms): 4.99k  [RESC0805(2012)_L]
R46  1.5k  [RESC0805(2012)_N]
R47#1  Resistance (Ohms): 75  [RESC0805(2012)_L]
R48#1  Resistance (Ohms): 6.98k  [RESC0805(2012)_N]  (hidden comment: 6K98 1% 0805(2012))
R49  Pot Connector  [AXIAL-0.3]
R53#1  Resistance (Ohms): 6.98k  [RESC0805(2012)_N]  (hidden comment: 6K98 1% 0805(2012))
R54#1  TBD  [RESC0805(2012)_N]
R55#1  TBD  [RESC0805(2012)_N]
R56#1  TBD  [RESC0805(2012)_N]
R61#1  TBD  [RESC0805(2012)_N]
R62#1  TBD  [RESC0805(2012)_N]
R63#1  TBD  [RESC0805(2012)_N]
R67#1  TBD  [RESC0805(2012)_N]
R68#1  TBD  [RESC0805(2012)_N]
R69#1  TBD  [RESC0805(2012)_N]
U8#1  LMC660AIMX  [D0014A_N]  (parts A,B of 4)
U9  MAX5496ETE+  [MAXM-T1655+3_M]

### Ports
SPIO_MISO, SPIO_SCLK, Thermistor_CS0

### Nets
+3.3: U9.5(VDD)
+5: P5#1.1 P8#1.1 R29#1.2 R31.1 R32#1.2 R46.2 R48#1.2 U8#1.4(V+)
+12: P3.1
+12 Safety: DS1#1.1(A) DS3#1.1(A) P3.2 P4#1.1 P6#1.1
GND: P9.2 Q1#1.3(S) Q3#1.3(S) R34#1.1 R38.1 R42#1.1 R43#1.1 R44#1.1 R49.1 R53#1.1 R67#1.1 R68#1.1 R69#1.1 U8#1.11(V-) U9.3(L2) U9.8(VSS) U9.10(L1) U9.12(GND)
Conning Tower Htr Out: P4#1.2 Q1#1.4(D) R30#1.2
CT Set_R: U9.11(W1)
CT Thermistor: C14#1.1 P5#1.2 R34#1.2 U8#1.2(IN1-)
CT_Set_R: R32#1.1 R35#1.2 R36#1.2 R37#1.2 R38.2 U8#1.3(IN1+)
Gearbox Htr Out: P6#1.2 Q3#1.4(D) R45#1.2
Gearbox Thermistor: C15.1 P8#1.2 R53#1.2 U8#1.6(IN2-)
GearBox_Set_R: R48#1.1 R49.2 R54#1.2 R55#1.2 R56#1.2 U8#1.5(IN2+) U9.2(W2)
Lid Thermistor: P9.1 R31.2
SPI0_MISO: U9.13(DIN) ; port SPIO_MISO
SPI0_SCLK: U9.16(SCLK) ; port SPIO_SCLK
Thermistor_CS0: U9.1(~{CS}) ; port Thermistor_CS0
NetC14#1_2: C14#1.2 R29#1.1 R33#1.1 U8#1.1(OUT1)
NetC15_2: C15.2 R46.1 R47#1.1 U8#1.7(OUT2)
NetDS1#1_2: DS1#1.2(K) R30#1.1
NetDS3#1_2: DS3#1.2(K) R45#1.1
NetQ1#1_1: Q1#1.1(G) R33#1.2
NetQ3#1_1: Q3#1.1(G) R47#1.2
NetR35#1_1: R35#1.1 R36#1.1 R37#1.1 R39#1.2 R40#1.2 R41#1.2
NetR39#1_1: R39#1.1 R40#1.1 R41#1.1 R42#1.2 R43#1.2 R44#1.2
NetR54#1_1: R54#1.1 R55#1.1 R56#1.1 R61#1.2 R62#1.2 R63#1.2
NetR61#1_1: R61#1.1 R67#1.2 R68#1.2 R69#1.2

Not connected (* = marked no-connect by the designer): R62#1 1; R63#1 1; U9 4(DNC) 6(NC)* 7(NC)* 9(DNC) 14(NC)* 15(NC)* 17(EP)

### Notes on the sheet
- (near P3) Bi-Metalic Switch
- (near R33#1) GPIO 1-3
- Labels drawn without touching a wire or pin: Board1 Thermistor
- Title
- Size:
- Date:
- Tabloid
- Number:
- Time:
- Revision:
- Sheet
- of
- ZLS Corporation
- 7801 North Lamar Blvd.
- Suite E-184
- Austin, Texas 78752  USA
- (512) 453-0288
- File:

### Library data of the parts
C14#1 C15 = CMP-1036-04795-1: as C7 on sheet Signal_Conditioner; Supplier 1: Digi-Key; Supplier Part Number 1: 490-1673-6-ND; RoHS: RoHS Compliant; Category: Capacitors; Stock 1: 891652; Pricing 1: 1=0.2, 10=0.145, 100=0.0683, 500=0.04788, 1000=0.03964 (USD); Packaging: Digi-Reel®; Part Status: Active; Voltage - Rated: 25V; Temperature Coefficient: X7R; Operating Temperature: -55°C ~ 125°C; Features: -; Ratings: -; Applications: General Purpose; Mounting Type: Surface Mount, MLCC; Package / Case: 0805 (2012 Metric); Size / Dimension: 0.079" L x 0.049" W (2.00mm x 1.25mm); Height - Seated (Max): -; Thickness (Max): 0.053" (1.35mm); Lead Spacing: -; Lead Style: -; ComponentLink1URL: http://www.murata.com/~/media/webrenewal/support/library/catalog/products/capacitor/mlcc/c02e.ashx; ComponentLink1Description: http://www.murata.com/~/media/webrenewal/support/library/catalog/products/capacitor/mlcc/c02e.ashx
DS1#1 DS3#1 = LED A/K: Manufacturer: Vishay / Lite-On; Lens Colour: Colorless; Lens Style: Diffused,Colorless; Viewing Angle: 130°; Luminous Intensity: 54mcd; Forward Current: 20mA; Forward Voltage: 2V; Power Rating: 75mW; Dominant Wavelength: 631nm; Lens Transparency: Clear; Number of Elements: 1; Wavelength: 639nm; Supplier 1: Digi-Key; Supplier Part Number 1: 160-1469-1-ND; Stock 1: 108191; Pricing 1: 1=0.31, 10=0.225, 25=0.1656, 100=0.1183, 250=0.0804, 500=0.071, 1000=0.0556 (USD); Mount: Surface Mount; Case/Package: 0805; Number of Pins: 2; Colour: Red; Case Code (Metric): 2012; Case Code (Imperial): 0805; Min Operating Temperature: -55°C; Max Operating Temperature: 85°C; Packaging: Tape and Reel; Package Quantity: 4000; Illumination Colour: Red; Test Current: 20mA; Power Dissipation: 75mW; Number of LEDs: 1; Length: 2.1mm; Height: 0.6mm; Width: 1mm; Depth: 0.6mm; Radiation Hardening: No; Lead Free: Lead Free; ComponentLink1URL: https://datasheet.ciiva.com/2110/s-110-ltst-s220krkt-2110132.pdf; ComponentLink1Description: https://datasheet.ciiva.com/2110/s-110-ltst-s220krkt-2110132.pdf; ComponentLink2URL: https://datasheet.ciiva.com/2110/s-110-ltst-s220krkt-2110133.pdf; ComponentLink2Description: https://datasheet.ciiva.com/2110/s-110-ltst-s220krkt-2110133.pdf; ComponentLink3URL: https://datasheet.ciiva.com/2110/s-110-ltst-s220krkt-2110134.pdf; ComponentLink3Description: https://datasheet.ciiva.com/2110/s-110-ltst-s220krkt-2110134.pdf; ComponentLink4URL: https://datasheet.ciiva.com/12403/lite-on-ltst-s220krkt-187389-12403798.pdf; ComponentLink4Description: https://datasheet.ciiva.com/12403/lite-on-ltst-s220krkt-187389-12403798.pdf; ComponentLink5URL: https://datasheet.ciiva.com/16345/lite-onltst-s220krkt-16345511.pdf; ComponentLink5Description: https://datasheet.ciiva.com/16345/lite-onltst-s220krkt-16345511.pdf; ComponentLink6URL: https://datasheet.ciiva.com/15118/getdatasheetpartid-225752-15118120.pdf; ComponentLink6Description: https://datasheet.ciiva.com/15118/getdatasheetpartid-225752-15118120.pdf; ComponentLink7URL: https://datasheet.ciiva.com/14633/0900766b80dc0b76-14633737.pdf; ComponentLink7Description: https://datasheet.ciiva.com/14633/0900766b80dc0b76-14633737.pdf; ComponentLink8URL: https://datasheet.ciiva.com/11775/0900766b80dc0b76-11775439.pdf; ComponentLink8Description: https://datasheet.ciiva.com/11775/0900766b80dc0b76-11775439.pdf
P3 P4#1 P5#1 P6#1 P8#1 P9 = IPL1-102-01-F-S-K: .100 TERMINAL ASSEMBLY; Manufacturer: Samtec Inc.; Connector Type: Header; Pitch - Mating: 0.100" (2.54mm); Number of Positions: 2; Number of Positions Loaded: All; Style: Board to Cable/Wire; Shrouding: Shrouded - 4 Wall; Contact Length - Mating: 0.215" (5.46mm); Contact Length - Post: 0.120" (3.05mm); Material Flammability Rating: UL94 V-0; Voltage Rating: 675VAC, 954VDC; Supplier 1: Digi-Key; Manufacturer Part Number: IPL1-102-01-F-S-K; RoHS: RoHS Compliant; Category: Connectors, Interconnects; Stock 1: 0; Pricing 1: 1=1.69 (USD); Packaging: Tube; Part Status: Active; Contact Type: Male Pin; Number of Rows: 1; Row Spacing - Mating: -; Mounting Type: Through Hole; Termination: Solder; Fastening Type: Locking Ramp; Overall Contact Length: -; Insulation Height: 0.320" (8.13mm); Contact Shape: Square; Contact Finish - Mating: Gold; Contact Finish Thickness - Mating: 3µin (0.08µm); Contact Finish - Post: Tin; Contact Material: Phosphor Bronze; Insulation Material: Liquid Crystal Polymer (LCP); Features: -; Operating Temperature: -55°C ~ 125°C; Ingress Protection: -; Insulation Color: Natural; Current Rating: -; Mated Stacking Heights: -; Contact Finish Thickness - Post: -; Applications: -; ComponentLink1URL: http://suddendocs.samtec.com/prints/ipl1-1xx-xx-xxx-s-xx-x-xx-mkt.pdf; ComponentLink1Description: http://suddendocs.samtec.com/prints/ipl1-1xx-xx-xxx-s-xx-x-xx-mkt.pdf
  P5#1 P6#1 P8#1: Supplier Part Number 1: IPL1-102-01-F-S-K-ND
Q1#1 Q3#1 = CMP-1058-00341-1: Power MOSFET, 30 V, 117 A, Single N-Channel, 3-Pin DPAK, Pb-Free, Tape and Reel; Manufacturer: On Semiconductor; Coss Typ (pF): 952; Qrr Typ (nC): 30; VGS Max (V): 20; ID Max (A): 117; Crss Typ (pF): 556; Channel Polarity: N Channel; Ciss Typ (pF): 4490; VGS(th) Max (V): 2.5; ComponentLink2Description: Datasheet; ComponentLink3Description: Package Specification; Mounting Technology: Surface Mount; PackageDescription: 3-Pin Flange Mount, Body 6.54 x 6.095 mm, Pitch 2.29 mm; PackageVersion: Rev. B, 06/2010; PartNumber: NTD4804NT4G; ComponentLink2URL: http://www.onsemi.cn/pub_link/Collateral/NTD4804N-D.PDF; RoHS: Pb-Free; Configuration: Single; DatasheetVersion: Rev. 8; PackageReference: DPAK-3-369AA-01; ComponentLink3URL: http://www.onsemi.cn/pub_link/Collateral/369AA.PDF; ComponentLink1Description: Manufacturer URL; Packing: Tape and Reel; Package Type: DPAK-3; ComponentLink1URL: http://www.onsemi.com/; V(BR)DSS Min (V): 30; Supplier 1: Digi-Key; Supplier Part Number 1: NTD4804NT4GOSDKR-ND
R29#1 R46 = CMP-1013-00606-1: 6K98 0.125W 1% 0805 (2012 Metric)  SMD
R30#1 R45#1 = CMP-1013-00393-1: Manufacturer: Vishay Dale; Manufacturer Part Number: CRCW08054K99FKEA; Tolerance: ±1%; Power (Watts): 0.125W, 1/8W; Temperature Coefficient: ±100ppm/°C; Supplier 1: Digi-Key; Supplier Part Number 1: 541-4.99KCCT-ND; RoHS: RoHS Compliant; Category: Resistors; Stock 1: 93740; Pricing 1: 1=0.1, 10=0.044, 100=0.0178, 1000=0.00802, 2500=0.00696 (USD); Packaging: Cut Tape (CT); Part Status: Active; Composition: Thick Film; Features: Automotive AEC-Q200; Operating Temperature: -55°C ~ 155°C; Package / Case: 0805 (2012 Metric); Supplier Device Package: 0805; Size / Dimension: 0.079" L x 0.049" W (2.00mm x 1.25mm); Height - Seated (Max): 0.020" (0.50mm); Failure Rate: -; ComponentLink1URL: http://www.vishay.com/docs/20035/dcrcwe3.pdf; ComponentLink1Description: http://www.vishay.com/docs/20035/dcrcwe3.pdf
R31 R32#1 R34#1 R48#1 R53#1 = CMP-1013-00606-1: 6K98 0.125W 1% 0805 (2012 Metric)  SMD; Manufacturer: Vishay Dale; Manufacturer Part Number: CRCW08056K98FKEA; Power (Watts): 0.125W, 1/8W; Temperature Coefficient: ±100ppm/°C; Supplier 1: Digi-Key; Supplier Part Number 1: 541-6.98KCCT-ND; RoHS: RoHS Compliant; Category: Resistors; Stock 1: 34245; Pricing 1: 1=0.1, 10=0.044, 100=0.0178, 1000=0.00802, 2500=0.00696 (USD); Packaging: Cut Tape (CT); Part Status: Active; Tolerance: ±1%; Composition: Thick Film; Features: Automotive AEC-Q200; Operating Temperature: -55°C ~ 155°C; Package / Case: 0805 (2012 Metric); Supplier Device Package: 0805; Size / Dimension: 0.079" L x 0.049" W (2.00mm x 1.25mm); Height - Seated (Max): 0.020" (0.50mm); Failure Rate: -; ComponentLink1URL: http://www.vishay.com/docs/20035/dcrcwe3.pdf; ComponentLink1Description: http://www.vishay.com/docs/20035/dcrcwe3.pdf
R33#1 R47#1 = CMP-1013-00393-1: Manufacturer: Vishay Dale; Manufacturer Part Number: CRCW080575R0FKEA; Tolerance: ±1%; Power (Watts): 0.125W, 1/8W; Temperature Coefficient: ±100ppm/°C; Supplier 1: Digi-Key; Supplier Part Number 1: 541-75.0CCT-ND; RoHS: RoHS Compliant; Category: Resistors; Stock 1: 32546; Pricing 1: 1=0.1, 10=0.044, 100=0.0178, 1000=0.00802, 2500=0.00696 (USD); Packaging: Cut Tape (CT); Part Status: Active; Composition: Thick Film; Features: Automotive AEC-Q200; Operating Temperature: -55°C ~ 155°C; Package / Case: 0805 (2012 Metric); Supplier Device Package: 0805; Size / Dimension: 0.079" L x 0.049" W (2.00mm x 1.25mm); Height - Seated (Max): 0.020" (0.50mm); Failure Rate: -; ComponentLink1URL: http://www.vishay.com/docs/20035/dcrcwe3.pdf; ComponentLink1Description: http://www.vishay.com/docs/20035/dcrcwe3.pdf
R35#1 R36#1 R37#1 R39#1 R40#1 R41#1 R42#1 R43#1 R44#1 R54#1 R55#1 R56#1 R61#1 R62#1 R63#1 R67#1 R68#1 R69#1 = CMP-1013-00606-1: 6K98 0.125W 1% 0805 (2012 Metric)  SMD; Manufacturer: Vishay Dale; Power (Watts): 0.125W, 1/8W; Temperature Coefficient: ±100ppm/°C; Supplier 1: Digi-Key; RoHS: RoHS Compliant; Category: Resistors; Stock 1: 34245; Pricing 1: 1=0.1, 10=0.044, 100=0.0178, 1000=0.00802, 2500=0.00696 (USD); Packaging: Cut Tape (CT); Part Status: Active; Resistance (Ohms): TBD; Tolerance: ±1%; Composition: Thick Film; Features: Automotive AEC-Q200; Operating Temperature: -55°C ~ 155°C; Package / Case: 0805 (2012 Metric); Supplier Device Package: 0805; Size / Dimension: 0.079" L x 0.049" W (2.00mm x 1.25mm); Height - Seated (Max): 0.020" (0.50mm); Failure Rate: -; ComponentLink1URL: http://www.vishay.com/docs/20035/dcrcwe3.pdf; ComponentLink1Description: http://www.vishay.com/docs/20035/dcrcwe3.pdf
R38 R49 = Res1: Resistor
U8#1 = CMP-0055-00899-3: CMOS Quad Operational Amplifier, 14-pin Narrow SOIC; Manufacturer: Texas Instruments; PackageTopMarking: NSUZXYTTE#*LMC660AIM; PowerWise: N; CompType: Amplifiers; RoHS: N; Code_JEDEC: MS-012AB; ComponentLink1Description: Datasheet URL; ComponentLink1URL: http://www.ti.com/general/docs/lit/getliterature.tsp?genericPartNumber=LMC660&fileType=pdf; Code_IPC: SOIC127P600-14; PackageDescription: Molded Package S.O., .150in Wide, 14 Lead; Package Reference: D0014A; PinCount: 14; PartId: 1
U9 = CMP-0023-00245-1: Dual 10k Digital Potentiometer (Voltage Divider) with 3-Wire Serial SPI Control Interface, Non-Volatile, Linear Taper, 1024 Steps, -40 to 85 degC, 16-pin TQFN (T1655+3), Pb-Free; PackageVersion: Rev. Q, 09/2011; Control Interface: 3-Wire Serial SPI; Code_JEDEC: MO220; Features: EEPROM Wiper Memory; ComponentLink1URL: http://www.maximintegrated.com/; DatasheetVersion: Rev. 2; ComponentLink1Description: Manufacturer URL; PartNumber: MAX5496ETE+; ComponentLink2Description: Datasheet; ComponentLink3Description: Package Specification; Applications: Fiber Communications, Power Supply Cal.; ComponentLink3URL: http://pdfserv.maximintegrated.com/package_dwgs/21-0140.PDF; ComponentLink2URL: http://datasheets.maximintegrated.com/en/ds/MAX5494-MAX5499.pdf; Mounting Technology: Surface Mount; PackageReference: T1655+3; PackageDescription: 16-Pin Thin Quad Flatpack, No Leads, Body 5 x 5 mm, Pitch 0.8 mm